# EAGLE design PulseOxi (EAGLE 9.6.2)
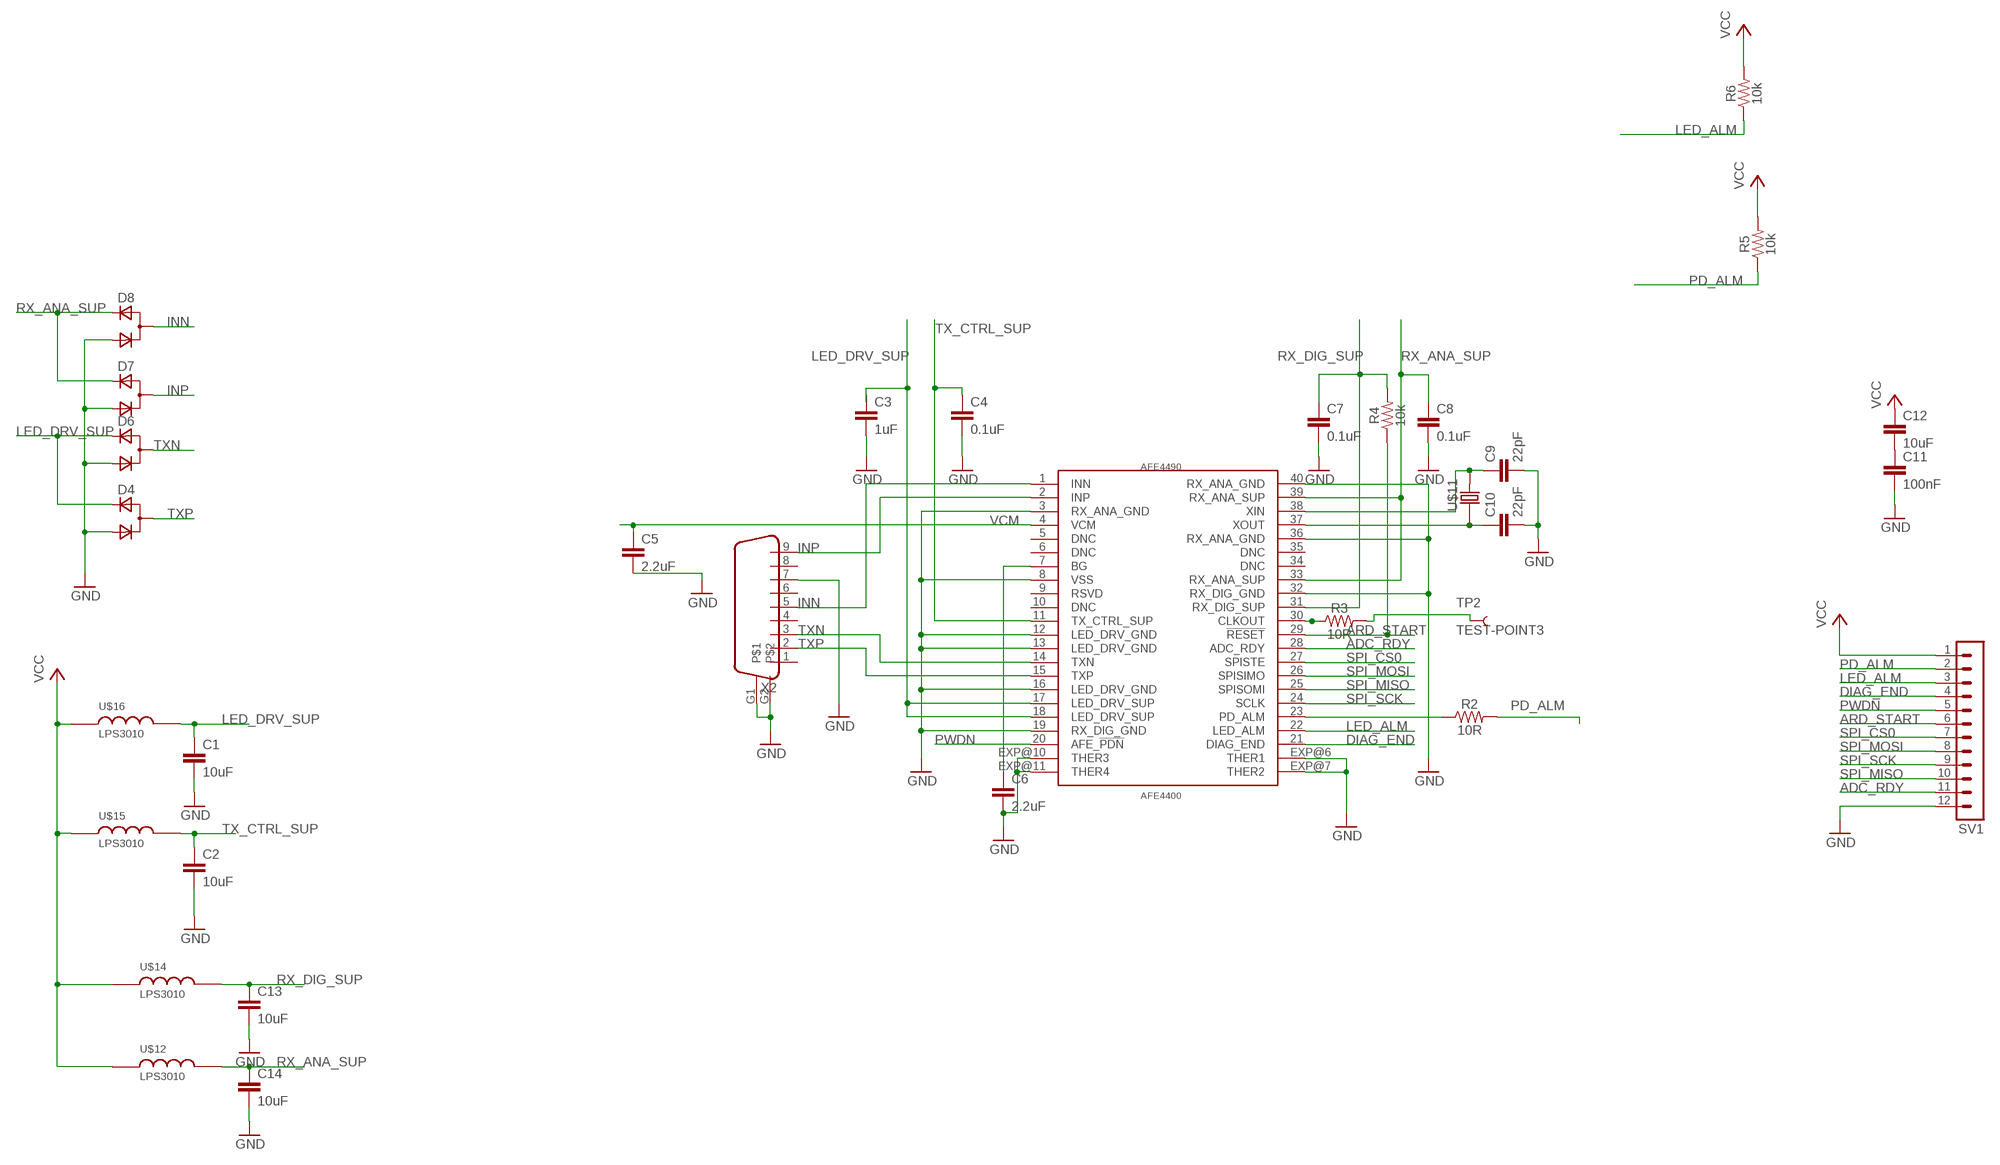
[diagram p0: schematic, sheet 1]

## Parts
AFE4490  AFE4400  [QFN-40]
C1  10uF  27PF-0603-50V-5%  [0603]
C2  10uF  27PF-0603-50V-5%  [0603]
C3  1uF  27PF-0603-50V-5%  [0603]
C4  0.1uF  27PF-0603-50V-5%  [0603]
C5  2.2uF  27PF-0603-50V-5%  [0603]
C6  2.2uF  27PF-0603-50V-5%  [0603]
C7  0.1uF  27PF-0603-50V-5%  [0603]
C8  0.1uF  27PF-0603-50V-5%  [0603]
C9  22pF  27PF-0603-50V-5%  [0603]
C10  22pF  27PF-0603-50V-5%  [0603]
C11  100nF  27PF-0603-50V-5%  [0603]
C12  10uF  27PF-0603-50V-5%  [0603]
C13  10uF  27PF-0603-50V-5%  [0603]
C14  10uF  27PF-0603-50V-5%  [0603]
D4  D_ACACSOT323  [SOT323]
D6  D_ACACSOT323  [SOT323]
D7  D_ACACSOT323  [SOT323]
D8  D_ACACSOT323  [SOT323]
R2  10R  1.8MOHM  [0603]
R3  10R  1.8MOHM  [0603]
R4  10k  1.8MOHM  [0603]
R5  10k  1.8MOHM  [0603]
R6  10k  1.8MOHM  [0603]
SV1  MA12-1  [MA12-1]
TP2  TEST-POINT3  [PAD.03X.03]
U$11  ABM3  [ABM3]
U$12  LPS3010  LPS  [LPS]
U$14  LPS3010  LPS  [LPS]
U$15  LPS3010  LPS  [LPS]
U$16  LPS3010  LPS  [LPS]
X2  DB9  [DB9]

## Nets
ADC_RDY: AFE4490.28(ADC_RDY) SV1.11
ARD_START: AFE4490.29(!RESET) R4.1 SV1.6
DIAG_END: AFE4490.21(DIAG_END) SV1.4
GND: AFE4490.3(RX_ANA_GND) AFE4490.8(VSS) AFE4490.12(LED_DRV_GND) AFE4490.13(LED_DRV_GND) AFE4490.16(LED_DRV_GND) AFE4490.19(RX_DIG_GND) AFE4490.32(RX_DIG_GND) AFE4490.36(RX_ANA_GND) AFE4490.40(RX_ANA_GND) AFE4490.EXP@6(THER1) AFE4490.EXP@7(THER2) AFE4490.EXP@10(THER3) AFE4490.EXP@11(THER4) C1.2 C2.2 C3.2 C4.2 C5.2 C6.2 C7.2 C8.2 C9.2 C10.2 C11.2 C13.2 C14.2 D4.2(C) D6.2(C) D7.2(C) D8.2(C) SV1.12 X2.7 X2.G1 X2.G2
INN: AFE4490.1(INN) D8.1(CA) X2.5
INP: AFE4490.2(INP) D7.1(CA) X2.9
LED_ALM: AFE4490.22(LED_ALM) R6.1 SV1.3
LED_DRV_SUP: AFE4490.17(LED_DRV_SUP) AFE4490.18(LED_DRV_SUP) C1.1 C3.1 D4.3(A) D6.3(A) U$16.2
N$2: C11.1 C12.2
N$4: AFE4490.30(CLKOUT) R3.1
N$5: R3.2 TP2.P$1
N$7: AFE4490.23(PD_ALM) R2.1
N$16: AFE4490.38(XIN) C9.1 U$11.2
N$19: AFE4490.37(XOUT) C10.1 U$11.1
N$20: AFE4490.7(BG) C6.1
PD_ALM: R2.2 R5.1 SV1.2
PWDN: AFE4490.20(AFE_!PDN) SV1.5
RX_ANA_SUP: AFE4490.33(RX_ANA_SUP) AFE4490.39(RX_ANA_SUP) C8.1 C14.1 D7.3(A) D8.3(A) U$12.2
RX_DIG_SUP: AFE4490.31(RX_DIG_SUP) C7.1 C13.1 R4.2 U$14.2
SPI_CS0: AFE4490.27(SPISTE) SV1.7
SPI_MISO: AFE4490.25(SPISOMI) SV1.10
SPI_MOSI: AFE4490.26(SPISIMO) SV1.8
SPI_SCK: AFE4490.24(SCLK) SV1.9
TX_CTRL_SUP: AFE4490.11(TX_CTRL_SUP) C2.1 C4.1 U$15.2
TXN: AFE4490.14(TXN) D6.1(CA) X2.3
TXP: AFE4490.15(TXP) D4.1(CA) X2.2
VCC: C12.1 R5.2 R6.2 SV1.1 U$12.1 U$14.1 U$15.1 U$16.1
VCM: AFE4490.4(VCM) C5.1
Unconnected: AFE4490.5(DNC) AFE4490.6(DNC) AFE4490.9(RSVD) AFE4490.10(DNC) AFE4490.34(DNC) AFE4490.35(DNC) X2.1 X2.4 X2.6 X2.8

## Library data of the parts
AFE4490 = circuitects:AFE4400
C1-C14 = SparkFun-Capacitors:27PF: 27pF ceramic capacitors A capacitor is a passive two-terminal electrical component used to store electrical energy temporarily in an electric field.; PROD_ID: CAP-09989; VALUE: 27pF
D4 D6-D8 = zetex:D_ACAC: Dual DIODE; OC_FARNELL: unknown; OC_NEWARK: unknown
R2-R6 = SparkFun-Resistors:1.8MOHM: 1.8 MOhms ±5% 0.1W, 1/10W Chip Resistor 0603; PROD_ID: RES-13994; VALUE: 1.8M
SV1 = con-lstb:MA12-1: PIN HEADER; OC_FARNELL: unknown; OC_NEWARK: unknown
TP2 = SparkFun:TEST-POINT
U$11 = circuitects:ABM3
U$12 U$14-U$16 = circuitects:LPS
X2 = circuitects:DB9: DB9 Connector Standard DB9 (D-Sub 9) serial connector. Can be used for CAN bus as well as RS485 and RS232. Footprint production proven. Spark Fun Electronics SKU : PRT-00429

## Board
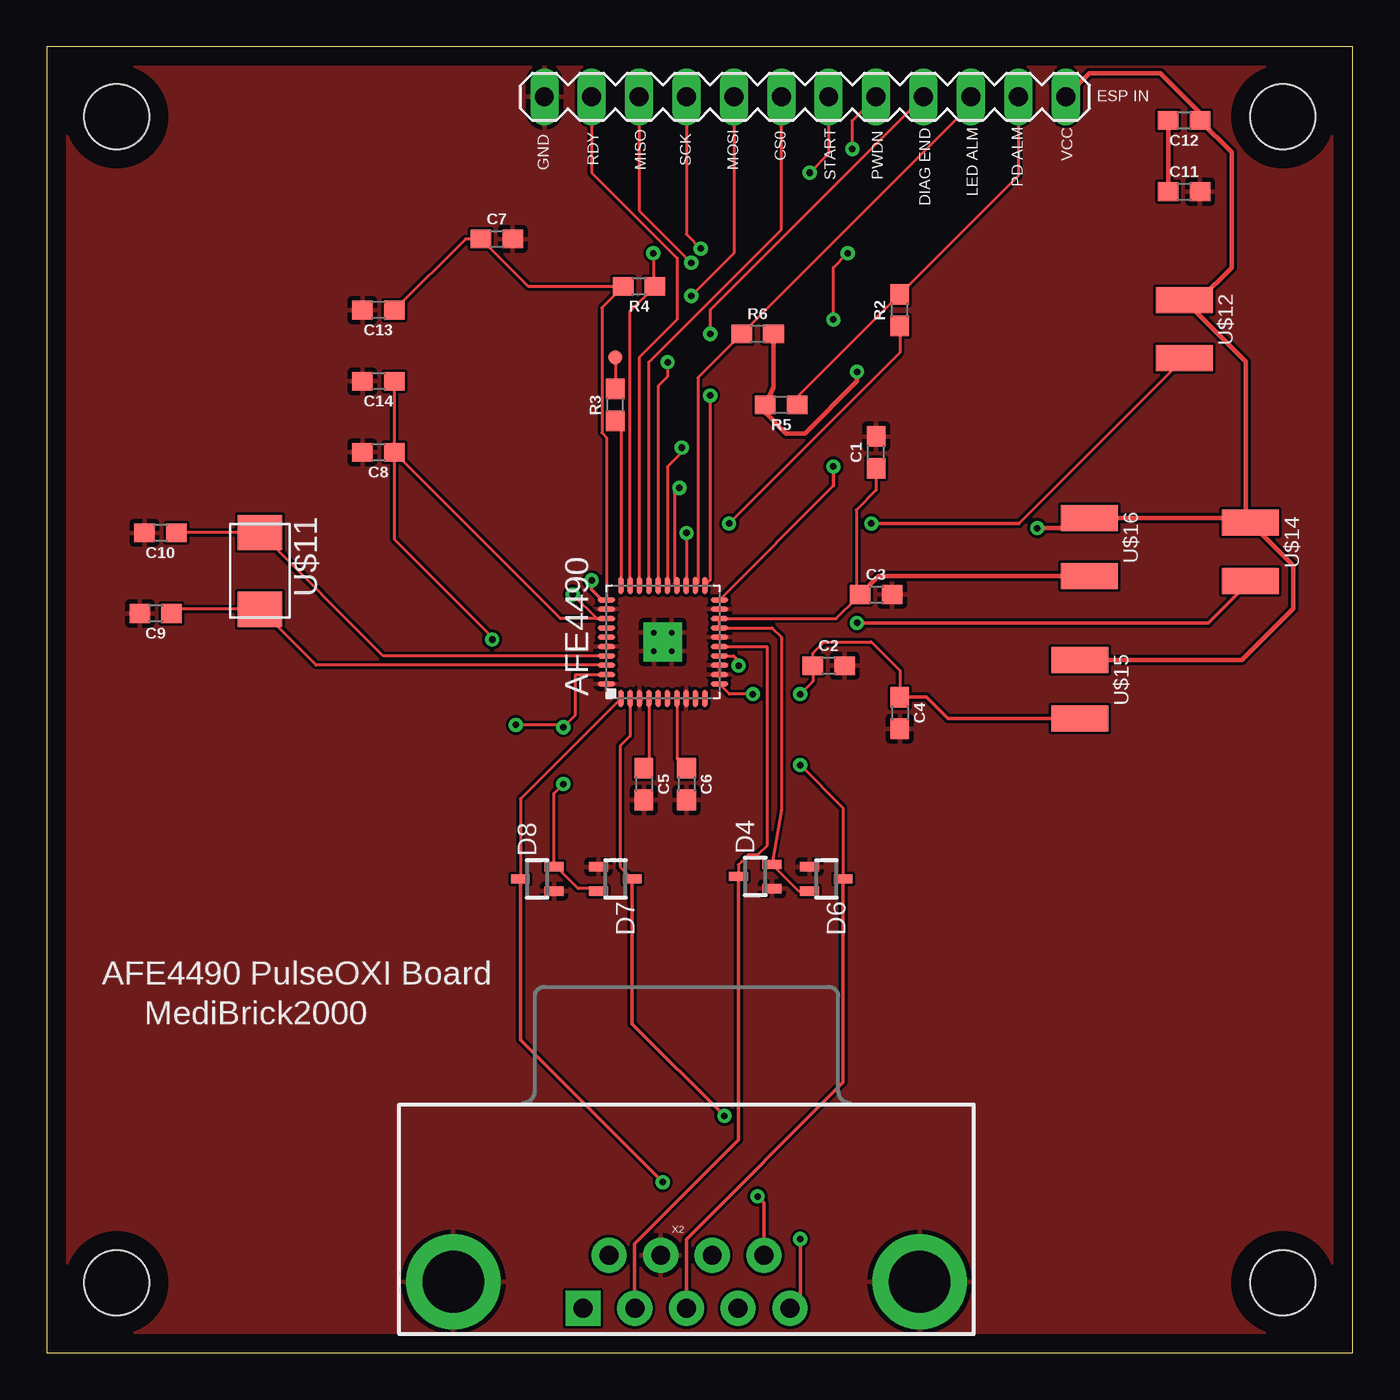
[diagram p1: board, top side]
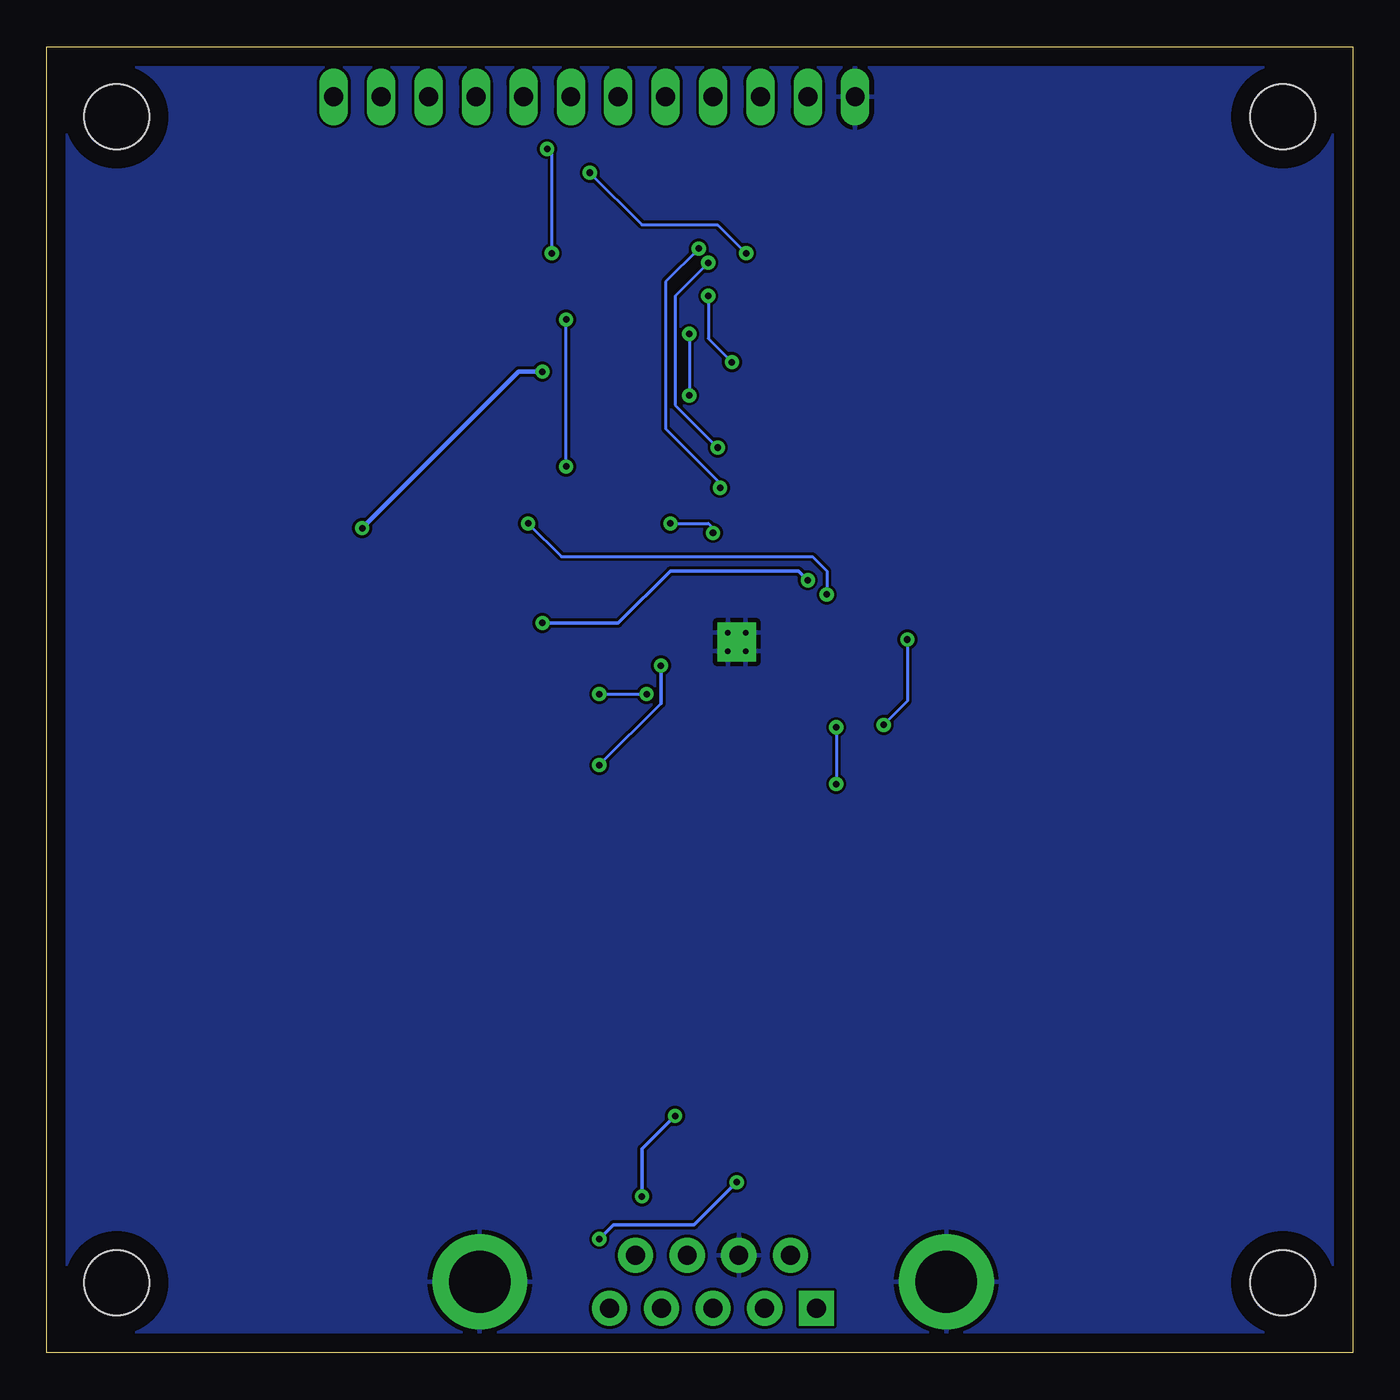
[diagram p2: board, bottom side, seen from below]

Size 70 x 70 mm. Coordinates in mm from the lower left corner, seen from the top.
Outline: 0,0 70,0 70,70 0,70 0,0
Copper layers (1*16): Top 0.035mm / dielectric 1.5mm / Bottom 0.035mm
Design rules "default": minimum track width 6mil, minimum drill 0.35mm, track to track 6mil, track to pad 6mil, pad to pad 6mil, via to via 6mil, smd to smd 6mil, copper to edge 40mil, drill to drill 6mil, minimum pad ring 10mil, minimum via ring 8mil, stop-mask expansion 4mil, vias tented up to drill 0mil, thermal gap 10mil
Holes 3.5 mm at 3.75,66.25 66.25,66.25 3.75,3.75 66.25,3.75

### Footprints (pad centres in the part's own frame; a part is rotated, then mirrored left to right if it is on the bottom)
QFN-40 = smd 0.95 x 0.28: 1 -3.025,2.25; 2 -3.025,1.75; 3 -3.025,1.25; 4 -3.025,0.75; 5 -3.025,0.25; 6 -3.025,-0.25; 7 -3.025,-0.75; 8 -3.025,-1.25; 9 -3.025,-1.75; 10 -3.025,-2.25; 21 3.025,-2.25; 22 3.025,-1.75; 23 3.025,-1.25; 24 3.025,-0.75; 25 3.025,-0.25; 26 3.025,0.25; 27 3.025,0.75; 28 3.025,1.25; 29 3.025,1.75; 30 3.025,2.25 | smd 0.28 x 0.95: 11 -2.25,-3.025; 12 -1.75,-3.025; 13 -1.25,-3.025; 14 -0.75,-3.025; 15 -0.25,-3.025; 16 0.25,-3.025; 17 0.75,-3.025; 18 1.25,-3.025; 19 1.75,-3.025; 20 2.25,-3.025; 31 2.25,3.025; 32 1.75,3.025; 33 1.25,3.025; 34 0.75,3.025; 35 0.25,3.025; 36 -0.25,3.025; 37 -0.75,3.025; 38 -1.25,3.025; 39 -1.75,3.025; 40 -2.25,3.025 | drill 0.3 pad 1.1 square: EXP@6 -0.5,0.475; EXP@7 0.5,0.475; EXP@10 -0.5,-0.475; EXP@11 0.5,-0.475
0603 = smd 1.1 x 1: 1 -0.85,0; 2 0.85,0
SOT323 = smd 0.5 x 1: 1 0,0.9; 2 -0.65,-0.9; 3 0.65,-0.9
MA12-1 = drill 1.016 long: 1 -13.97,0; 2 -11.43,0; 3 -8.89,0; 4 -6.35,0; 5 -3.81,0; 6 -1.27,0; 7 1.27,0; 8 3.81,0; 9 6.35,0; 10 8.89,0; 11 11.43,0; 12 13.97,0
PAD.03X.03 = smd 0.762 x 0.762: P$1 0,0
ABM3 = smd 1.9 x 2.4: 1 -2.05,0; 2 2.05,0
LPS = smd 1.4 x 3.05: 1 -1.56,0; 2 1.56,0
DB9 = drill 1.016 pad 1.88 square: 1 -5.54,-1.42 | drill 1.016 pad 1.88: 2 -2.77,-1.42; 3 0,-1.42; 4 2.77,-1.42; 5 5.54,-1.42; 6 -4.15,1.42; 7 -1.38,1.42; 8 1.38,1.42; 9 4.15,1.42 | drill 3.302 pad 5.08: G1 -12.5,0; G2 12.5,0

### Placement (x,y rotation side)
AFE4490  33.02,38.1 90 top
C1  44.45,48.26 90 top
C2  41.91,36.83 0 top
C3  44.45,40.64 0 top
C4  45.72,34.29 270 top
C5  32,30.48 270 top
C6  34.29,30.48 270 top
C7  24.13,59.69 0 top
C8  17.78,48.26 180 top
C9  5.84,39.62 180 top
C10  6.1,43.94 180 top
C11  60.96,62.23 0 top
C12  60.96,66.04 180 top
C13  17.78,55.88 180 top
C14  17.78,52.07 180 top
D4  37.97,25.53 90 top
D6  41.78,25.4 270 top
D7  30.48,25.4 270 top
D8  26.29,25.4 90 top
R2  45.72,55.88 90 top
R3  30.48,50.8 90 top
R4  31.75,57.15 180 top
R5  39.37,50.8 180 top
R6  38.1,54.61 0 top
SV1  40.64,67.31 180 top
TP2  30.48,53.34 0 top
U$11  11.43,41.91 270 top
U$12  60.96,54.86 270 top
U$14  64.52,42.93 270 top
U$15  55.37,35.56 270 top
U$16  55.88,43.18 270 top
X2  34.29,3.81 0 top

### Tracks (layer width: path | path; a pad name or v marks a point on that pad's centre or on a via)
ADC_RDY
  Top 0.152: SV1.11 29.21,63.25 33.78,58.67 33.78,55.37 31.75,53.34 31.75,41.15 AFE4490.28
ARD_START  (via drill 0.35)
  Top 0.152: AFE4490.29 31.27,55.82 R4.1 32.51,57.24 v32.51,58.93 | SV1.6 41.91,64.26 v40.89,63.25
  Bottom 0.152: v40.89,63.25 38.1,60.45 34.04,60.45 v32.51,58.93
DIAG_END  (via drill 0.35)
  Top 0.152: SV1.4 35.56,55.88 v35.56,54.61 | v35.56,51.31 35.56,41.41 AFE4490.21
  Bottom 0.152: v35.56,54.61 v35.56,51.31
GND
  pour Top: 0,69.85 0,0 69.85,0 69.85,69.85
  pour Bottom: 0,69.85 0,0 69.85,0 69.85,69.85
INN  (via drill 0.35)
  Top 0.152: AFE4490.1 25.39,29.69 D8.1
  Top 0.2: D8.1 25.39,16.77 v33.02,9.14 | v40.39,6.1 40.39,2.95 X2.5
  Bottom 0.2: v33.02,9.14 35.31,6.86 39.62,6.86 v40.39,6.1
INP  (via drill 0.35)
  Top 0.152: AFE4490.2 31.27,33.05 30.73,32.51 30.73,26.05 D7.1
  Top 0.2: D7.1 31.38,17.64 v36.32,12.7 | v38.1,8.38 38.44,8.04 X2.9
  Bottom 0.2: v36.32,12.7 38.1,10.92 v38.1,8.38
LED_ALM
  Top 0.152: SV1.3 49.53,66.89 R6.1 34.9,52.26 34.9,41.25 AFE4490.22
LED_DRV_SUP
  Top 0.152: 43.39,40.43 42.31,39.35 AFE4490.18 AFE4490.17 38.87,38.85 39.37,38.35 39.37,29.09 D4.3 40.3,24.75 D6.3 | 43.39,40.43 C3.1 | C1.1 44.45,46.23 43.39,45.17 43.39,40.43
  Top 0.254: U$16.2 44.58,41.62 C3.1
N$2
  Top 0.254: C12.2 C11.1
N$4
  Top 0.152: R3.1 30.77,49.66 AFE4490.30
N$5
  Top 0.152: TP2.P$1 R3.2
N$7  (via drill 0.35)
  Top 0.152: v34.29,43.94 34.29,41.15 AFE4490.23 | R2.1 45.72,53.59 v36.58,44.45
  Bottom 0.152: v34.29,43.94 34.29,44.2 34.54,44.45 v36.58,44.45
N$16
  Top 0.152: AFE4490.38 14.44,36.85 U$11.2 6.93,39.86 C9.1
N$19
  Top 0.152: AFE4490.37 18.04,37.35 U$11.1 6.96,43.96 C10.1
N$20
  Top 0.152: AFE4490.7 33.78,35.06 33.78,31.84 C6.1
PD_ALM
  Top 0.152: SV1.2 52.07,63.08 45.93,56.94 R2.2 40.22,51.23 R5.1
PWDN  (via drill 0.35)
  Top 0.152: AFE4490.20 42.16,46.47 | v42.16,55.37 42.16,58.17 v42.93,58.93 | v43.18,64.52 43.18,66.04 SV1.5
  Top 0.2: 42.16,46.47 v42.16,47.5
  Bottom 0.152: v42.16,47.5 v42.16,55.37 | v42.93,58.93 42.93,64.26 v43.18,64.52
RX_ANA_SUP  (via drill 0.35)
  Top 0.152: C14.1 C8.1 | D7.3 29.45,24.88 28.49,24.88 27.32,26.05 D8.3 27.19,29.98 v27.69,30.48 | AFE4490.39 28.32,36.35 28.32,34.16 v27.69,33.53 27.56,33.66 v25.15,33.66 | C8.1 27.54,39.35 AFE4490.33 29.48,39.35 v28.19,40.64 | U$12.2 52.11,44.45 | C8.1 18.63,43.6 23.88,38.35 v23.88,38.23
  Top 0.2: 52.11,44.45 v44.2,44.45
  Bottom 0.152: v27.69,33.53 v27.69,30.48 | v44.2,44.45 42.42,42.67 28.96,42.67 28.19,41.91 v28.19,40.64 | v23.88,38.23 23.88,34.92 v25.15,33.66
RX_DIG_SUP  (via drill 0.35)
  Top 0.152: C13.1 22.44,59.69 C7.1 25.82,57.15 R4.2 29.75,56 29.75,49.3 30,49.06 30,40.39 AFE4490.31
  Top 0.2: U$14.2 62.27,39.12 v43.43,39.12 | v29.21,41.4 29.21,40.89 29.72,40.39 30,40.39
  Bottom 0.2: v43.43,39.12 39.37,39.12 36.58,41.91 29.72,41.91 v29.21,41.4
SPI_CS0
  Top 0.152: AFE4490.27 32.27,53.1 39.37,60.2 SV1.7
SPI_MISO  (via drill 0.35)
  Top 0.152: SV1.10 31.75,61.21 v34.54,58.42 | v34.04,48.51 34.04,48.26 33.27,47.49 AFE4490.25
  Bottom 0.152: v34.54,58.42 36.32,56.64 36.32,50.8 v34.04,48.51
SPI_MOSI  (via drill 0.35)
  Top 0.152: SV1.8 36.83,58.93 v34.54,56.64 | v33.27,53.09 33.27,52.32 32.77,51.82 AFE4490.26
  Bottom 0.152: v34.54,56.64 34.54,54.36 v33.27,53.09
SPI_SCK  (via drill 0.35)
  Top 0.152: SV1.9 34.29,59.94 v35.05,59.18 | v33.91,46.35 33.64,46.09 33.64,41.25 AFE4490.24
  Bottom 0.152: v35.05,59.18 36.83,57.4 36.83,49.53 33.78,46.48 v33.91,46.35
TX_CTRL_SUP  (via drill 0.35)
  Top 0.152: v40.39,35.31 41.06,35.98 C2.1 41.06,37.5 41.66,38.1 44.2,38.1 45.72,36.58 C4.1 | v37.85,35.31 36.59,35.31 AFE4490.11
  Top 0.2: U$15.2 48.3,34 47.16,35.14 C4.1
  Bottom 0.152: v40.39,35.31 v37.85,35.31
TXN  (via drill 0.35)
  Top 0.152: AFE4490.14 36.82,37.35 | v40.39,31.5 42.68,29.2 D6.1
  Top 0.2: D6.1 42.68,14.49 34.29,6.1 X2.3 | 36.82,37.35 37.08,37.08 v37.08,36.83
  Bottom 0.152: 37.08,34.8 v40.39,31.5
  Bottom 0.2: v37.08,36.83 37.08,34.8
TXP
  Top 0.152: AFE4490.15 38.6,37.85 38.61,37.85 38.61,27.18 38.1,26.67 37.59,26.67 37.07,26.15 D4.1
  Top 0.2: D4.1 37.07,11.42 31.5,5.84 31.5,2.41 X2.2
VCC  (via drill 0.35)
  Top 0.254: SV1.1 55.88,68.58 59.69,68.58 61.81,66.46 C12.1 63.5,64.35 63.5,58.17 61.76,56.42 U$12.1 64.26,53.12 64.26,44.74 | R6.2 38.95,51.76 R5.2 38.52,50.38 39.62,49.28 40.64,49.28 43.43,52.07 v43.43,52.58 | 56.42,44.49 56.39,44.45 56.17,44.45 U$16.1 | U$15.1 64.04,37.12 66.8,39.88 66.8,42.2 U$14.1 64.26,44.74 | U$16.1 64.26,44.74 | U$16.1 55.34,44.2 v53.09,44.2
  Bottom 0.254: v53.09,44.2 44.7,52.58 v43.43,52.58
VCM
  Top 0.152: AFE4490.4 32.27,31.6 C5.1

### Text on the board
tNames: ESP IN | RDY | SCK | CS0 | VCC | GND | MISO | MOSI | START | PWDN | LED ALM | PD ALM | DIAG END | AFE4490 PulseOXI Board | MediBrick2000